# Altium schematic sheet salo_controler.SchDoc
size A
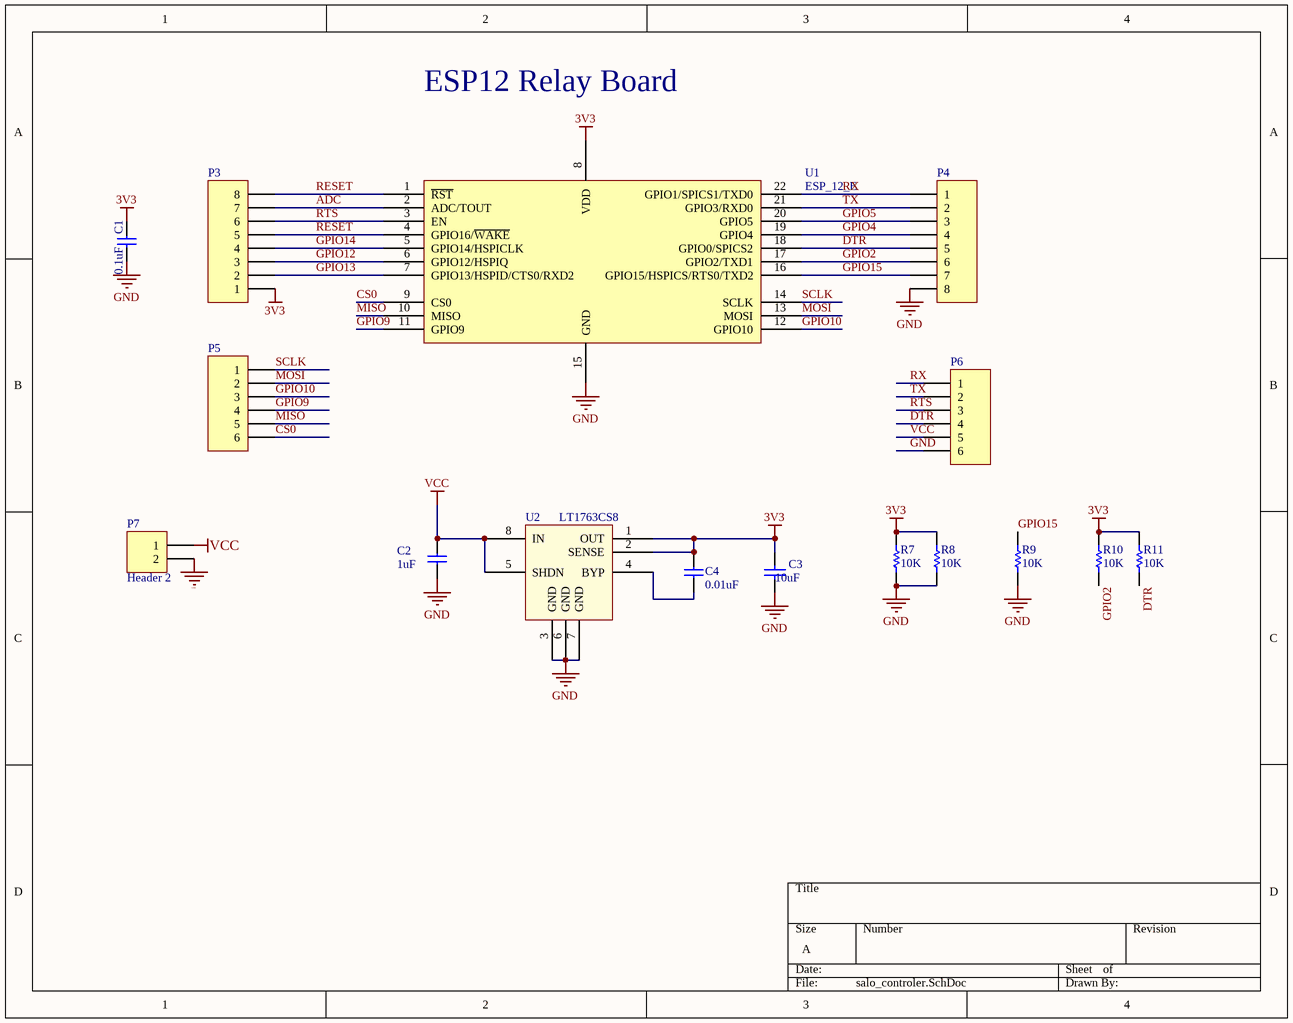
[diagram p0: salo_controler.SchDoc]

## Parts
C1  0.1uF  [CAPC1608X06L]
C2  1uF  [CAPC1608X06L]
C3  value 10uF  [C0805]  (hidden comment: Cap)
C4  0.01uF  [CAPC1005X04L]
P3  Header 8  [HDR1X8]  (value not drawn)
P4  Header 8  [HDR1X8]  (value not drawn)
P5  Header 6  [HDR1X6]  (value not drawn)
P6  Header 6  [HDR1X6]  (value not drawn)
P7  Header 2  [HDR1X2]
R7  value 10K  [R0805]  (hidden comment: Res1)
R8  value 10K  [R0805]  (hidden comment: Res1)
R9  value 10K  [R0805]  (hidden comment: Res1)
R10  value 10K  [R0805]  (hidden comment: Res1)
R11  value 10K  [R0805]  (hidden comment: Res1)
U1  ESP_12_E  [ESP_12_E]
U2  LT1763CS8  [SOIC8]

## Nets
3V3: C1.2 C3.2 C4.2 P3.1 R7.2 R8.2 R10.2 R11.2 U1.8(VDD) U2.1(OUT) U2.2(SENSE)
GND: C1.1 C2.1 C3.1 P4.8 P6.6 P7.2 R7.1 R8.1 R9.1 U1.15(GND) U2.3(GND) U2.6(GND) U2.7(GND)
VCC: C2.2 P6.5 P7.1 U2.5(SHDN) U2.8(IN)
ADC: P3.7 U1.2(ADC/TOUT)
CS0: P5.6 U1.9(CS0)
DTR: P4.5 P6.4 R11.1 U1.18(GPIO0/SPICS2)
GPIO2: P4.6 R10.1 U1.17(GPIO2/TXD1)
GPIO4: P4.4 U1.19(GPIO4)
GPIO5: P4.3 U1.20(GPIO5)
GPIO9: P5.4 U1.11(GPIO9)
GPIO10: P5.3 U1.12(GPIO10)
GPIO12: P3.3 U1.6(GPIO12/HSPIQ)
GPIO13: P3.2 U1.7(GPIO13/HSPID/CTS0/RXD2)
GPIO14: P3.4 U1.5(GPIO14/HSPICLK)
GPIO15: P4.7 R9.2 U1.16(GPIO15/HSPICS/RTS0/TXD2)
MISO: P5.5 U1.10(MISO)
MOSI: P5.2 U1.13(MOSI)
RESET: P3.5 P3.8 U1.1(~{RST}) U1.4(GPIO16/~{WAKE})
RTS: P3.6 P6.3 U1.3(EN)
RX: P4.1 P6.1 U1.22(GPIO1/SPICS1/TXD0)
SCLK: P5.1 U1.14(SCLK)
TX: P4.2 P6.2 U1.21(GPIO3/RXD0)
NetC4_1: C4.1 U2.4(BYP)

## Notes on the sheet
- ESP12 Relay Board

## Library data of the parts
C1 C2 = CAP_0603: Capacitor, X5R, ±10%; Part Number: C0603-4µ7; Value: 4.7µF; Note: 6.3V; Artikkelnr Noca: 20069060; Artikkelnr Simpro: N.A.; Manufacturer: *; Manufacturer Part Number: *; Datasheet: *; LatestRevisionDate: 2009-11-23; Pin Count: 2; Publisher: Nordic Semiconductor; Published: 2009-05-08; Supplier: *; Supplier part number: *; 2nd source Supplier: *; 2nd source part number: *; Footprint Doc: 0603
C3 = Cap: Capacitor
C4 = CAP_0402: Capacitor, NP0, ±2%; Part Number: C0402-12p; Value: 12pF; Note: 50V; Artikkelnr Noca: 20029159; Artikkelnr Simpro: N.A.; Manufacturer: *; Manufacturer Part Number: *; Datasheet: *; LatestRevisionDate: 2011-05-11; Pin Count: 2; Publisher: Nordic Semiconductor; Published: 2009-05-08; Supplier: *; Supplier part number: *; 2nd source Supplier: *; 2nd source part number: *; Footprint Doc: 0402
P3 P4 = Header 8: Header, 8-Pin; LatestRevisionDate: 17-Jul-2002; LatestRevisionNote: Re-released for DXP Platform.; Publisher: Altium Limited
P5 P6 = Header 6: Header, 6-Pin; LatestRevisionDate: 17-Jul-2002; LatestRevisionNote: Re-released for DXP Platform.; Publisher: Altium Limited
P7 = Header 2: Header, 2-Pin; LatestRevisionDate: 17-Jul-2002; LatestRevisionNote: Re-released for DXP Platform.; Publisher: Altium Limited
R7-R11 = Res1: Resistor; Published: 8-Jun-2000; LatestRevisionDate: 17-Jul-2002; LatestRevisionNote: Re-released for DXP Platform.; PackageReference: AXIAL-0.3; Publisher: Altium Limited; PackageDescription: Axial Device, Thru-Hole; 2 Leads; 0.3 in Pin Spacing
U1 = ESP_12_E: ESP-12 Wi-Fi Module by AI-Thinker; IC: ESP8266-EX; Vendor: Ai-thinker